# Altium schematic sheet smart_puzzle.SchDoc
size A4; SheetNumber: 1; SheetTotal: 1
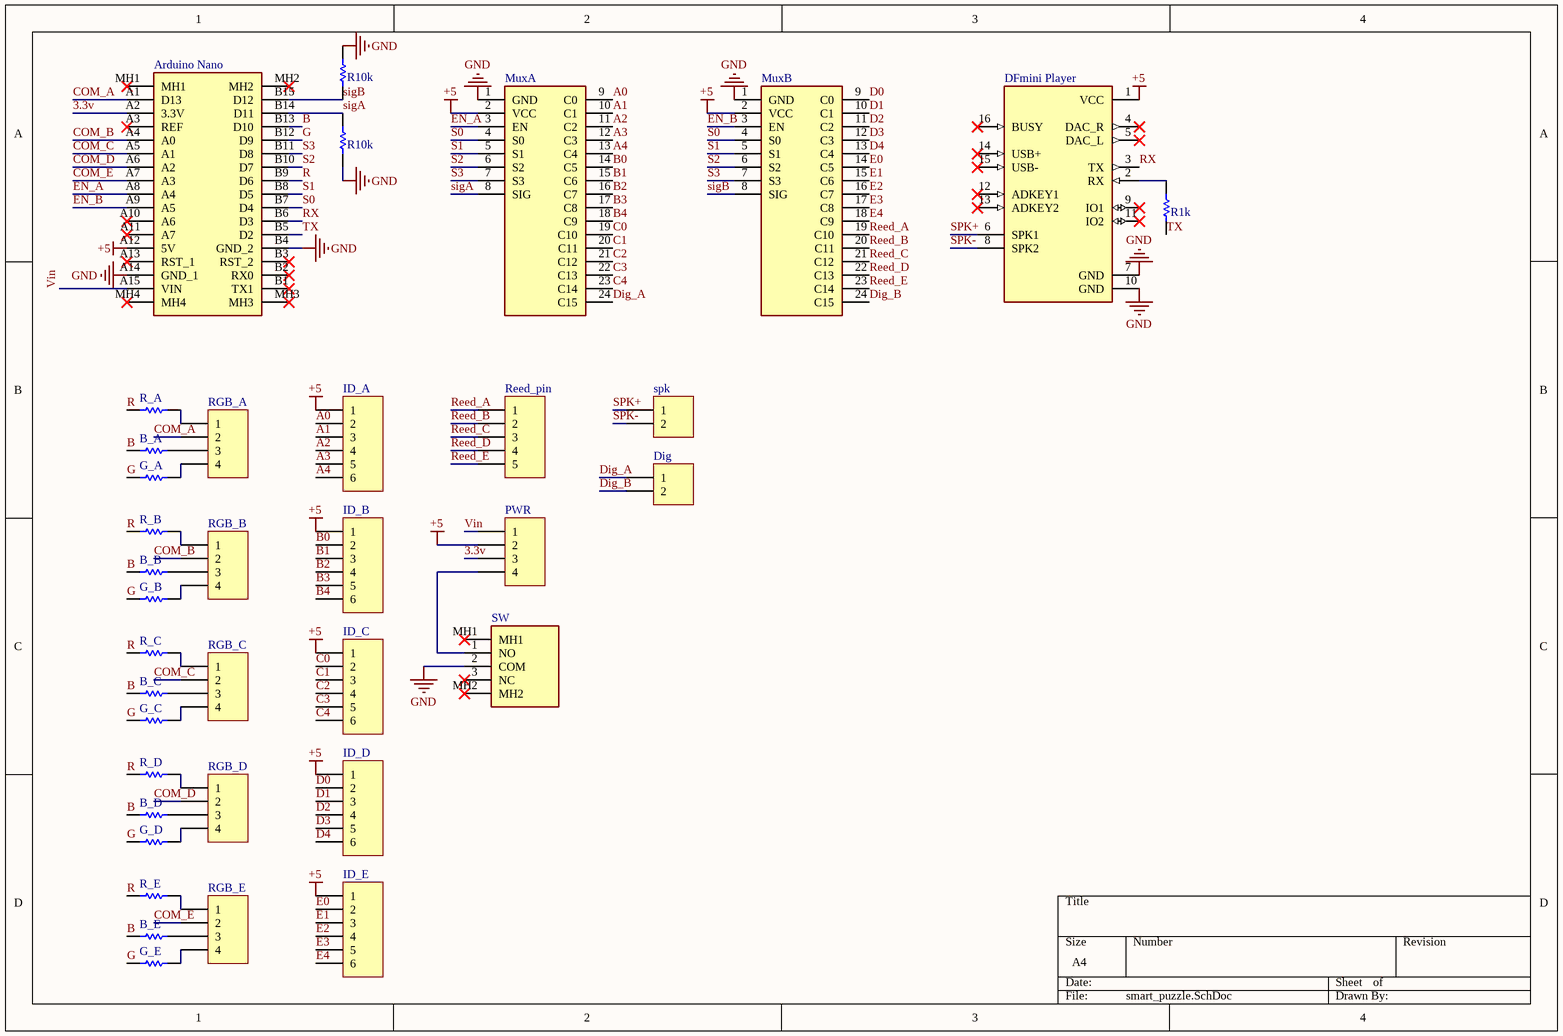
[diagram p0: smart_puzzle.SchDoc]

## Parts
(Parts that share a designator on the sheet are numbered #1, #2 ... from top to bottom, then left to right.)
Arduino_Nano  ABX00028  [ABX00028]  (value not drawn)
B_A  Resistor 0.25W  [Resistor 0.25W]  (value not drawn)
B_B  Resistor 0.25W  [Resistor 0.25W]  (value not drawn)
B_C  Resistor 0.25W  [Resistor 0.25W]  (value not drawn)
B_D  Resistor 0.25W  [Resistor 0.25W]  (value not drawn)
B_E  Resistor 0.25W  [Resistor 0.25W]  (value not drawn)
DFmini_Player  DFmini_player  [DFmini_player]  (value not drawn)
Dig  Header 2 Male  [Header 2 Male]  (value not drawn)
G_A  Resistor 0.25W  [Resistor 0.25W]  (value not drawn)
G_B  Resistor 0.25W  [Resistor 0.25W]  (value not drawn)
G_C  Resistor 0.25W  [Resistor 0.25W]  (value not drawn)
G_D  Resistor 0.25W  [Resistor 0.25W]  (value not drawn)
G_E  Resistor 0.25W  [Resistor 0.25W]  (value not drawn)
ID_A  Header 6 Male  [Header 6 Male]  (value not drawn)
ID_B  Header 6 Male  [Header 6 Male]  (value not drawn)
ID_C  Header 6 Male  [Header 6 Male]  (value not drawn)
ID_D  Header 6 Male  [Header 6 Male]  (value not drawn)
ID_E  Header 6 Male  [Header 6 Male]  (value not drawn)
MuxA  Component_1  [CD74HC4067]  (value not drawn)
MuxB  Component_1  [CD74HC4067]  (value not drawn)
PWR  Header 4 Male  [Header 4 Male]  (value not drawn)
R1k  Resistor 0.25W  [Resistor 0.25W]  (value not drawn)
R10k#1  Resistor 0.25W  [Resistor 0.25W]  (value not drawn)
R10k#2  Resistor 0.25W  [Resistor 0.25W]  (value not drawn)
R_A  Resistor 0.25W  [Resistor 0.25W]  (value not drawn)
R_B  Resistor 0.25W  [Resistor 0.25W]  (value not drawn)
R_C  Resistor 0.25W  [Resistor 0.25W]  (value not drawn)
R_D  Resistor 0.25W  [Resistor 0.25W]  (value not drawn)
R_E  Resistor 0.25W  [Resistor 0.25W]  (value not drawn)
Reed_pin  Header 5 Male  [Header 5 Male]  (value not drawn)
RGB_A  Header 4 Male  [Header 4 Male]  (value not drawn)
RGB_B  Header 4 Male  [Header 4 Male]  (value not drawn)
RGB_C  Header 4 Male  [Header 4 Male]  (value not drawn)
RGB_D  Header 4 Male  [Header 4 Male]  (value not drawn)
RGB_E  Header 4 Male  [Header 4 Male]  (value not drawn)
spk  Header 2 Male  [Header 2 Male]  (value not drawn)
SW  OS102011MS2QN1C  [OS102011MS2QN1C]  (value not drawn)

## Nets
+5: Arduino_Nano.A12(5V) DFmini_Player.1(VCC) ID_A.1 ID_B.1 ID_C.1 ID_D.1 ID_E.1 MuxA.2(VCC) MuxB.2(VCC) PWR.2
GND: Arduino_Nano.A14(GND_1) Arduino_Nano.B4(GND_2) DFmini_Player.7(GND) DFmini_Player.10(GND) MuxA.1(GND) MuxB.1(GND) R10k#1.1 R10k#2.1 SW.2(COM)
3.3v: Arduino_Nano.A2(3.3V) PWR.3
A0: ID_A.2 MuxA.9(C0)
A1: ID_A.3 MuxA.10(C1)
A2: ID_A.4 MuxA.11(C2)
A3: ID_A.5 MuxA.12(C3)
A4: ID_A.6 MuxA.13(C4)
B: Arduino_Nano.B13(D10) B_A.1 B_B.1 B_C.1 B_D.1 B_E.1
B0: ID_B.2 MuxA.14(C5)
B1: ID_B.3 MuxA.15(C6)
B2: ID_B.4 MuxA.16(C7)
B3: ID_B.5 MuxA.17(C8)
B4: ID_B.6 MuxA.18(C9)
C0: ID_C.2 MuxA.19(C10)
C1: ID_C.3 MuxA.20(C11)
C2: ID_C.4 MuxA.21(C12)
C3: ID_C.5 MuxA.22(C13)
C4: ID_C.6 MuxA.23(C14)
COM_A: Arduino_Nano.A1(D13) RGB_A.2
COM_B: Arduino_Nano.A4(A0) RGB_B.2
COM_C: Arduino_Nano.A5(A1) RGB_C.2
COM_D: Arduino_Nano.A6(A2) RGB_D.2
COM_E: Arduino_Nano.A7(A3) RGB_E.2
D0: ID_D.2 MuxB.9(C0)
D1: ID_D.3 MuxB.10(C1)
D2: ID_D.4 MuxB.11(C2)
D3: ID_D.5 MuxB.12(C3)
D4: ID_D.6 MuxB.13(C4)
Dig_A: Dig.1 MuxA.24(C15)
Dig_B: Dig.2 MuxB.24(C15)
E0: ID_E.2 MuxB.14(C5)
E1: ID_E.3 MuxB.15(C6)
E2: ID_E.4 MuxB.16(C7)
E3: ID_E.5 MuxB.17(C8)
E4: ID_E.6 MuxB.18(C9)
EN_A: Arduino_Nano.A8(A4) MuxA.3(EN)
EN_B: Arduino_Nano.A9(A5) MuxB.3(EN)
G: Arduino_Nano.B12(D9) G_A.1 G_B.1 G_C.1 G_D.1 G_E.1
R: Arduino_Nano.B9(D6) R_A.1 R_B.1 R_C.1 R_D.1 R_E.1
Reed_A: MuxB.19(C10) Reed_pin.1
Reed_B: MuxB.20(C11) Reed_pin.2
Reed_C: MuxB.21(C12) Reed_pin.3
Reed_D: MuxB.22(C13) Reed_pin.4
Reed_E: MuxB.23(C14) Reed_pin.5
RX: Arduino_Nano.B6(D3) DFmini_Player.3(TX)
S0: Arduino_Nano.B7(D4) MuxA.4(S0) MuxB.4(S0)
S1: Arduino_Nano.B8(D5) MuxA.5(S1) MuxB.5(S1)
S2: Arduino_Nano.B10(D7) MuxA.6(S2) MuxB.6(S2)
S3: Arduino_Nano.B11(D8) MuxA.7(S3) MuxB.7(S3)
sigA: Arduino_Nano.B14(D11) MuxA.8(SIG) R10k#2.2
sigB: Arduino_Nano.B15(D12) MuxB.8(SIG) R10k#1.2
SPK+: DFmini_Player.6(SPK1) spk.1
SPK-: DFmini_Player.8(SPK2) spk.2
TX: Arduino_Nano.B5(D2) R1k.2
Vin: Arduino_Nano.A15(VIN) PWR.1
NetB_A_2: B_A.2 RGB_A.3
NetB_B_2: B_B.2 RGB_B.3
NetB_C_2: B_C.2 RGB_C.3
NetB_D_2: B_D.2 RGB_D.3
NetB_E_2: B_E.2 RGB_E.3
NetDFmini_Player_2: DFmini_Player.2(RX) R1k.1
NetG_A_2: G_A.2 RGB_A.4
NetG_B_2: G_B.2 RGB_B.4
NetG_C_2: G_C.2 RGB_C.4
NetG_D_2: G_D.2 RGB_D.4
NetG_E_2: G_E.2 RGB_E.4
NetPWR_4: PWR.4 SW.1(NO)
NetR_A_2: R_A.2 RGB_A.1
NetR_B_2: R_B.2 RGB_B.1
NetR_C_2: R_C.2 RGB_C.1
NetR_D_2: R_D.2 RGB_D.1
NetR_E_2: R_E.2 RGB_E.1

Not connected (* = marked no-connect by the designer): Arduino_Nano A3(REF)* A10(A6)* A11(A7)* A13(RST_1)* B1(TX1)* B2(RX0)* B3(RST_2)* MH1* MH2* MH3* MH4*; DFmini_Player 4(DAC_R)* 5(DAC_L)* 9(IO1)* 11(IO2)* 12(ADKEY1)* 13(ADKEY2)* 14(USB+)* 15(USB-)* 16(BUSY)*; SW 3(NC)* MH1* MH2*

## Library data of the parts
Arduino_Nano = ABX00028: Integrated Circuit; Manufacturer_Name: Arduino; Datasheet Link: https://store.arduino.cc/arduino-nano-every; Height: 10mm; Manufacturer_Part_Number: ABX00028; Mouser Part Number: 782-ABX00028; Mouser Price/Stock: https://www.mouser.co.uk/ProductDetail/Arduino/ABX00028?qs=PzGy0jfpSMtit6rnFl8mVg%3D%3D; Arrow Part Number: ABX00028; Arrow Price/Stock: https://www.arrow.com/en/products/abx00028/arduino-corporation?region=nac
DFmini_Player = DFmini_player: Dfplayer - a Mini Mp3 Player; MP: DFR0299; Package: None; Value: *; Price: None; Availability: Unavailable
SW = OS102011MS2QN1C: Switch; Manufacturer_Name: C & K COMPONENTS; Datasheet Link: http://uk.rs-online.com/web/p/products/1546147; Height: 8.7mm; Manufacturer_Part_Number: OS102011MS2QN1C; Mouser Part Number: 611-OS102011MS2QN1C; Mouser Price/Stock: https://www.mouser.co.uk/ProductDetail/CK/OS102011MS2QN1C?qs=FgXbtR4Gg7KP4hs8ueQ7Wg%3D%3D; Arrow Part Number: OS102011MS2QN1C; Arrow Price/Stock: https://www.arrow.com/en/products/os102011ms2qn1c/ck?region=europe